# Altium schematic sheet AnalogInterface.SchDoc: Analog Interface
size Letter; Engineer: Nathan Petersen; DocumentNumber: 11; Revision: v1.2; SheetNumber: 11; SheetTotal: 26
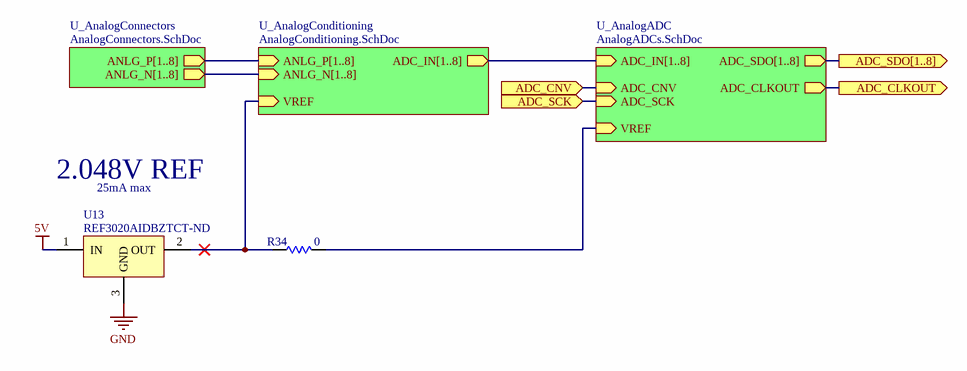
[diagram p0: AnalogInterface.SchDoc]

## Parts
R34  value 0  [1206-RES]  (hidden comment: Resistor)
U13  Supplier Part Number 1: REF3020AIDBZTCT-ND  [SOT23-3]  (hidden comment: REF3020AIDBZT)

## Sub-sheets
U_AnalogADC = AnalogADCs.SchDoc: ADC_IN[1..8] (in), ADC_SDO[1..8] (out), ADC_CNV (in), ADC_SCK (in), ADC_CLKOUT (out), VREF (in)
U_AnalogConditioning = AnalogConditioning.SchDoc: ADC_IN[1..8] (out), ANLG_N[1..8] (in), ANLG_P[1..8] (in), VREF (in)
U_AnalogConnectors = AnalogConnectors.SchDoc: ANLG_P[1..8] (out), ANLG_N[1..8] (out)

## Ports
ADC_CLKOUT (out), ADC_CNV (in), ADC_SCK (in), ADC_SDO[1..8] (out)

## Nets
5V: U13.1(IN)
GND: U13.3(GND)
ADC_CLKOUT: port ADC_CLKOUT, sheet U_AnalogADC/ADC_CLKOUT
ADC_CNV: port ADC_CNV, sheet U_AnalogADC/ADC_CNV
ADC_SCK: port ADC_SCK, sheet U_AnalogADC/ADC_SCK
NetR34_1: R34.1 U13.2(OUT) ; sheet U_AnalogConditioning/VREF
NetR34_2: R34.2 ; sheet U_AnalogADC/VREF

## Buses and harness runs
bus port ADC_SDO[1..8] = sheet U_AnalogADC/ADC_SDO[1..8]
bus sheet U_AnalogADC/ADC_IN[1..8] = sheet U_AnalogConditioning/ADC_IN[1..8]
bus sheet U_AnalogConditioning/ANLG_N[1..8] = sheet U_AnalogConnectors/ANLG_N[1..8]
bus sheet U_AnalogConditioning/ANLG_P[1..8] = sheet U_AnalogConnectors/ANLG_P[1..8]

## Notes on the sheet
- 2.048V REF
- 25mA max
- Title:
- File:
- Sheet:
- of
- Revision:
- Time:
- Date:
- Engineer:

## Library data of the parts
U13 = REF3020AIDBZT: Series Voltage Reference IC ±0.2% 25mA SOT-23-3; Supplier 1: Digi-Key
R34 = Resistor: Supplier 1: Digi-Key; Supplier Part Number 1: 311-0.0ERCT-ND